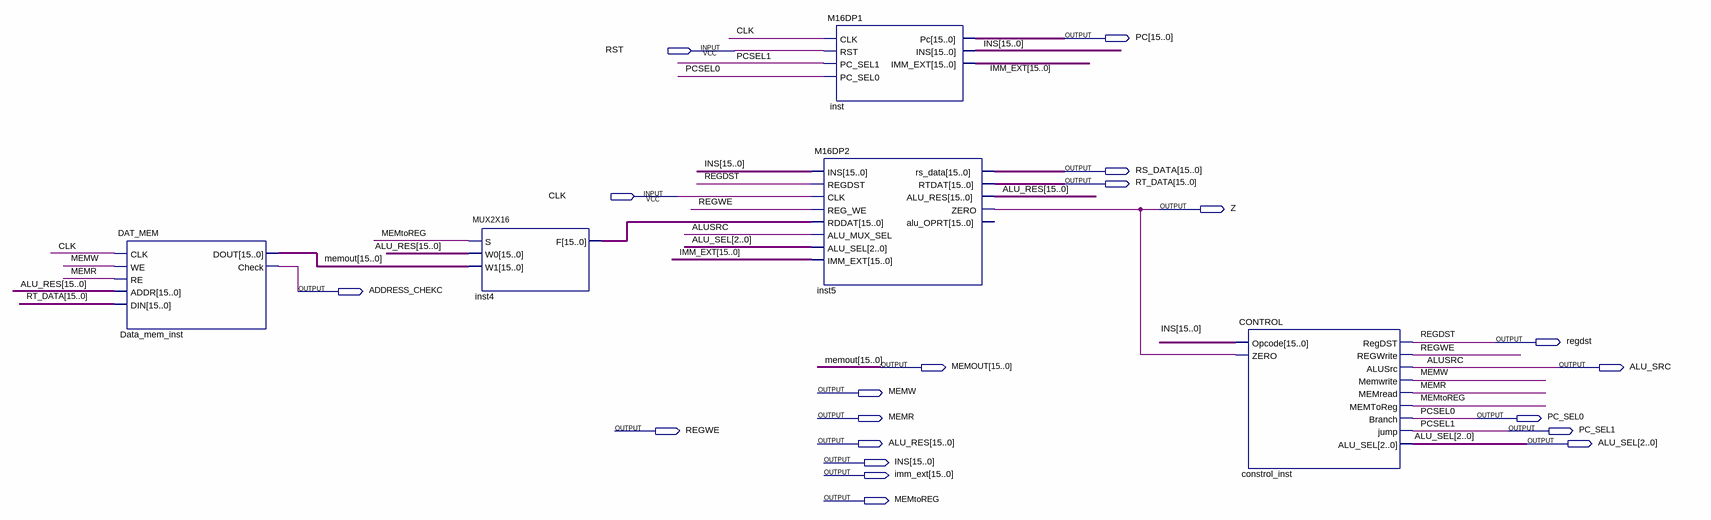
[diagram p0: schematic sheet]
// Quartus schematic M16DP.bdf as structural Verilog: 5 symbols, 20 pins
module M16DP (
  input  RST,
  input  CLK,
  output [15:0] PC,
  output [15:0] RS_DATA,
  output [15:0] RT_DATA,
  output Z,
  output ADDRESS_CHEKC,
  output regdst,
  output [15:0] MEMOUT,
  output ALU_SRC,
  output MEMW,
  output MEMR,
  output PC_SEL0,
  output REGWE,
  output PC_SEL1,
  output [15:0] ALU_RES,
  output [2:0] ALU_SEL,
  output [15:0] INS,
  output [15:0] imm_ext,
  output MEMtoREG
);

  wire [15:0] inst4_f;

  DAT_MEM Data_mem_inst (
    .CLK(CLK), .WE(MEMW), .RE(MEMR), .ADDR(ALU_RES), .DIN(RT_DATA), .DOUT(MEMOUT), .Check(ADDRESS_CHEKC));
  MUX2X16 inst4 (.S(MEMtoREG), .W0(ALU_RES), .W1(MEMOUT), .F(inst4_f));
  M16DP2 inst5 (
    .INS(INS), .REGDST(regdst), .CLK(CLK), .REG_WE(REGWE), .RDDAT(inst4_f), .ALU_MUX_SEL(ALU_SRC),
    .ALU_SEL(ALU_SEL), .IMM_EXT(imm_ext), .rs_data(RS_DATA), .RTDAT(RT_DATA), .ALU_RES(ALU_RES), .ZERO(Z));  // open: alu_OPRT
  M16DP1 inst (.CLK(CLK), .RST(RST), .PC_SEL1(PC_SEL1), .PC_SEL0(PC_SEL0), .Pc(PC), .INS(INS), .IMM_EXT(imm_ext));
  CONTROL constrol_inst (
    .Opcode(INS), .ZERO(Z), .RegDST(regdst), .REGWrite(REGWE), .ALUSrc(ALU_SRC), .Memwrite(MEMW),
    .MEMread(MEMR), .MEMToReg(MEMtoREG), .Branch(PC_SEL0), .jump(PC_SEL1), .ALU_SEL(ALU_SEL));

  // Other names for the same wires on the sheet: ALUSRC = ALU_SRC; PCSEL0 = PC_SEL0; PCSEL1 = PC_SEL1
endmodule
